# EAGLE design p_injector (EAGLE 9.6.2)
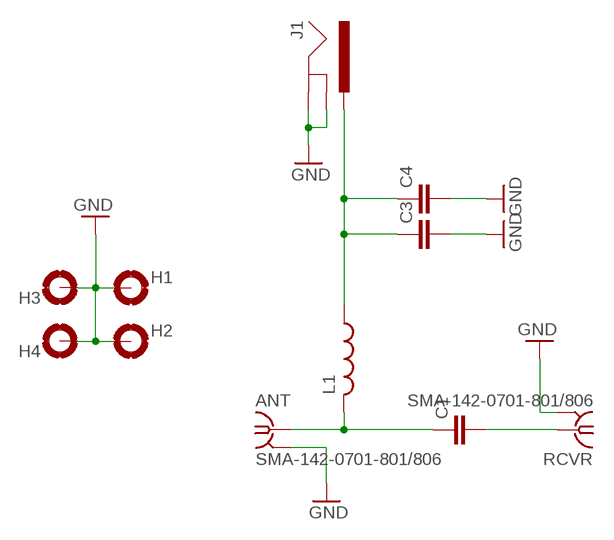
[diagram p0: schematic, sheet 1]

## Parts
ANT  SMA-142-0701-801/806  [J502-ND-142-0701-801/806]
C1  C_0805_PTH  [C0805K]
C3  C_0805_SMD  [C0805]
C4  C_0805_SMD  [C0805]
H1  MOUNT-PAD-ROUND3.0  [3,0-PAD]
H2  MOUNT-PAD-ROUND3.0  [3,0-PAD]
H3  MOUNT-PAD-ROUND3.0  [3,0-PAD]
H4  MOUNT-PAD-ROUND3.0  [3,0-PAD]
J1  POWER_JACKPOWER_JACK_SLOT  [POWER_JACK_PTH_SLOT]
L1  L_0805_PTH  [M0805]
RCVR  SMA-142-0701-801/806  [J502-ND-142-0701-801/806]

## Nets
GND: ANT.G@1 ANT.G@2 ANT.G@3 ANT.G@4 C3.2 C4.2 H1.B3,0(MOUNT) H2.B3,0(MOUNT) H3.B3,0(MOUNT) H4.B3,0(MOUNT) J1.GND J1.GNDBREAK RCVR.G@1 RCVR.G@2 RCVR.G@3 RCVR.G@4
N$1: ANT.1 C1.1 C1.P$1 L1.2 L1.P$2
N$2: C1.2 C1.P$2 RCVR.1
N$3: C3.1 C4.1 J1.PWR L1.1 L1.P$1

## Library data of the parts
ANT RCVR = con-coax:SMA-: SMA 50 Ohm End Launch Jack Receptacle - Round Contact Johnson Components Source: www.johnsoncomponents.com .. J502-ND.pdf; MF: JOHNSON COMPONENTS; MPN: 142-0701-801; OC_FARNELL: 1608592; OC_NEWARK: 90F2624
C1 = mylib:C_0805_PTH
C3 C4 = mylib:C_0805_SMD
H1-H4 = holes:MOUNT-PAD-ROUND: MOUNTING PAD, round
J1 = SparkFun-Connectors:POWER_JACK: Power Jack Connector This is the standard 5.5mm barrel jack for power. The PTH is the most common, proven, reliable, footprint. The Slot footprint only works if the mill layer is transmitted to the PCB fab house so be warned. Here are the connectors we sell at SparkFun: DC Barrel Power Jack/Connector <https://www.sparkfun.com/products/119> (PRT-00119) DC Barrel Power Jack/Connector (SMD) <https://www.sparkfun.com/products/12748> (PRT-12748) DC Barrel Jack Adapter - Breadboard Compatible <https://www.sparkfun.com/products/10811> (PRT-10811) It is used on this SparkFun product (and many, many others): SparkFun RedBoard - Programmed with Arduino <https://www.sparkfun.com/products/12757> (DEV-12757) Also, if you need a mating power supply or connector, please check these out: Wall Adapter Power Supply - 9VDC 650mA <https://www.sparkfun.com/products/298> (TOL-00298) DC Barrel Jack Adapter - Male <https://www.sparkfun.com/products/10287> (PRT-10287); PROD_ID: CONN-08197
L1 = mylib:L_0805_PTH

## Board
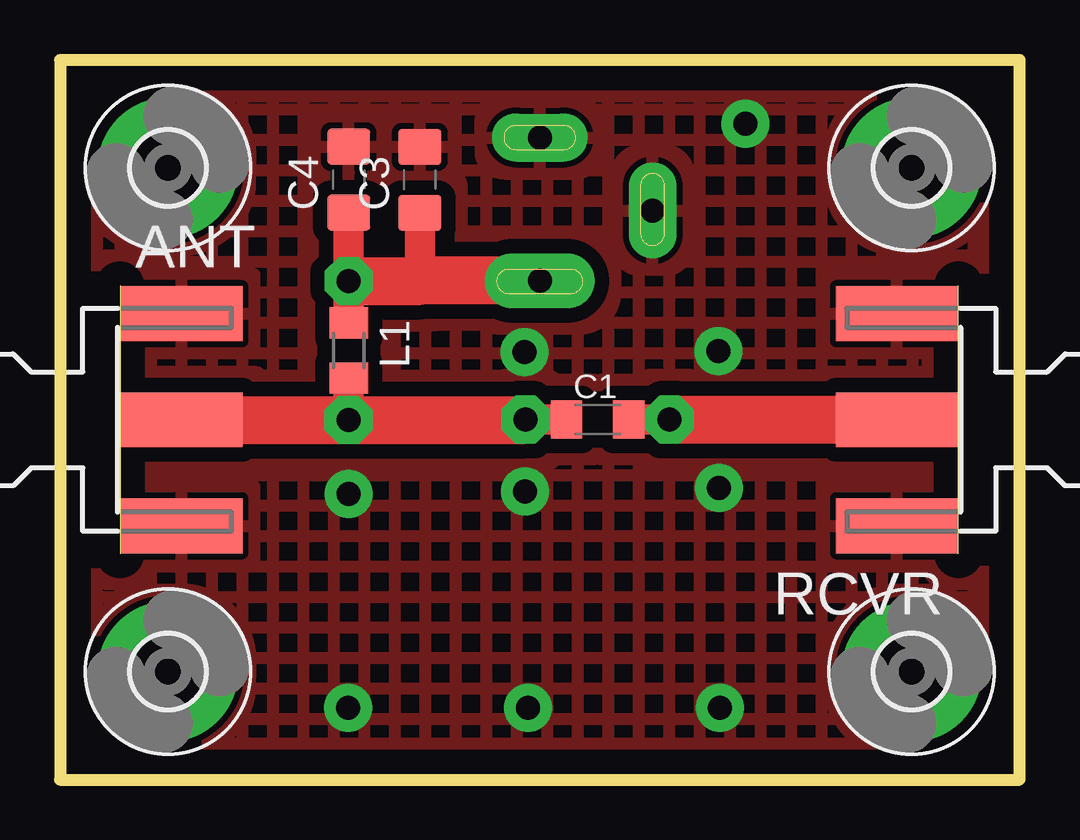
[diagram p1: board, top side]
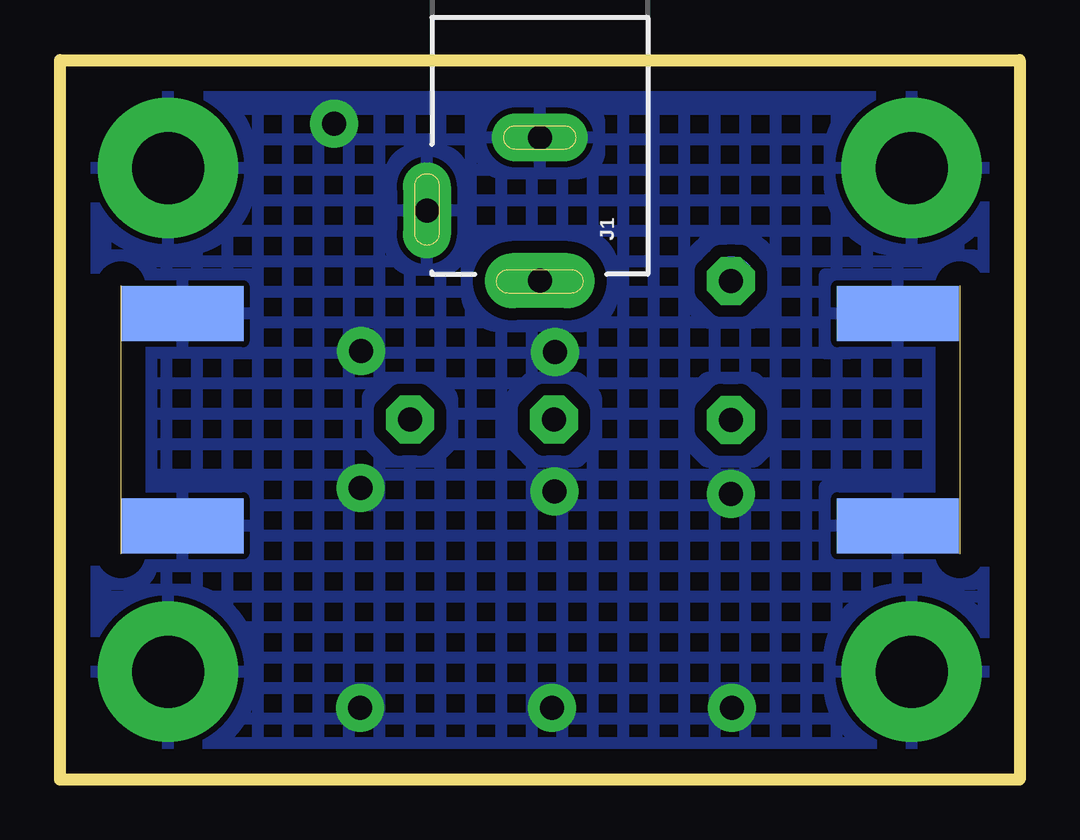
[diagram p2: board, bottom side, seen from below]

Size 40 x 30 mm. Coordinates in mm from the lower left corner, seen from the top.
Outline: 0,0 40,0 40,30 0,30 0,0
Copper layers (1*16): Top 0.035mm / dielectric 1.5mm / Bottom 0.035mm
Design rules "default": minimum track width 6mil, minimum drill 0.35mm, track to track 6mil, track to pad 6mil, pad to pad 6mil, via to via 6mil, smd to smd 6mil, copper to edge 40mil, drill to drill 6mil, minimum pad ring 10mil, minimum via ring 8mil, stop-mask expansion 4mil, vias tented up to drill 0mil, thermal gap 10mil

### Footprints (pad centres in the part's own frame; a part is rotated, then mirrored left to right if it is on the bottom)
J502-ND-142-0701-801/806 = smd 5.08 x 2.286: 1 2.565,0; G@1 2.565,4.42; G@2 2.565,-4.42 | smd 5.08 x 2.286 bottom: G@3 2.565,4.42; G@4 2.565,-4.42
C0805K = smd 1.3 x 1.6: 1 -1.3,0; 2 1.3,0 | drill 1 pad 2 octagon: P$1 -3,0; P$2 3,0
C0805 = smd 1.5 x 1.8: 1 -1.377,0; 2 1.377,0
3,0-PAD = drill 3 pad 5.842: B3,0 0,0
POWER_JACK_PTH_SLOT = drill 1 pad 2 long: GND 0,0; GNDBREAK -3.048,4.699 | drill 1 pad 2.3 long: PWR -5.969,0
M0805 = smd 1.3 x 1.6: 1 -1.15,0; 2 1.15,0 | drill 1 pad 2 octagon: P$1 -2.9,0; P$2 2.9,0

### Placement (x,y rotation side)
ANT  2.5,15 0 top
C1  22.41,15.01 0 top
C3  15,25 90 top
C4  12.04,25.01 90 top
H1  4.5,25.5 0 top
H2  4.5,4.5 0 top
H3  35.5,4.5 0 top
H4  35.5,25.5 0 top
J1  20,26.77 90 bottom
L1  12.04,17.89 270 top
RCVR  37.45,15 180 top

### Tracks (layer width: path | path; a pad name or v marks a point on that pad's centre or on a via)
GND  (via drill 1 pad 2)
  other vias: 12.03,11.9 19.38,12.02 27.47,12.15 28.57,27.35 19.37,17.82 19.5,3 12,3 27.5,3 27.44,17.86
  pour Top (isolate 0.6, hatched): -3,35 -3,-3.5 45,-3.5 45,35
  pour Bottom (isolate 0.5, hatched): 45.5,-4.5 -3.5,-4.5 -3.5,35.5 45.5,35.5
N$1
  Top 1.27: L1.P$2 L1.2 | C1.P$1 C1.1
  Top 2: ANT.1 L1.P$2 19.39,14.99 C1.P$1
N$2
  Top 1.27: C1.P$2 C1.2
  Top 2: C1.P$2 RCVR.1
N$3
  Top 1.27: C3.1 15,20.79 | L1.1 L1.P$1 C4.1
  Top 2: L1.P$1 15,20.79 15.01,20.8 J1.PWR
  Bottom 2: 12.02,20.81 L1.P$1